# EAGLE design Singularitron Breathalyzer Module (EAGLE 7.3.0)
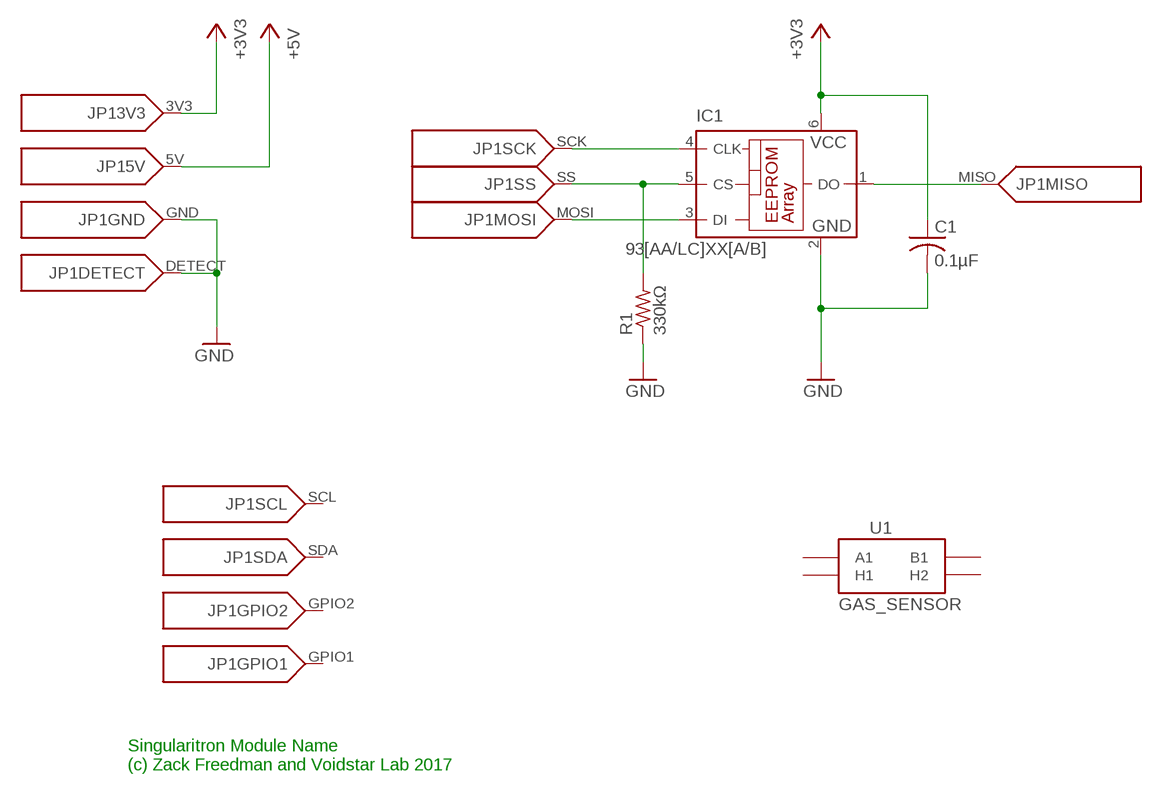
[diagram p0: schematic, sheet 1]

## Parts
C1  0.1µF  C-USC0603  [C0603]
IC1  93[AA/LC]XX[A/B]  93AA76A  [SOT23-6]
JP1  SINGULARITRON_CART_BASE  [SINGULARITRON_CART_BASE]
R1  330kΩ  R-US_R0603  [R0603]
U1  GAS_SENSOR  [MQ-3]

## Nets
+3V3: C1.1 IC1.6(VCC) JP1.3V3
+5V: JP1.5V
GND: C1.2 IC1.2(GND) JP1.DETECT JP1.GND R1.1
N$1: IC1.5(CS) JP1.SS R1.2
N$5: IC1.4(CLK) JP1.SCK
N$6: IC1.3(DI) JP1.MOSI
N$7: IC1.1(DO) JP1.MISO
Unconnected: JP1.GPIO1 JP1.GPIO2 JP1.SCL JP1.SDA U1.A1 U1.B1 U1.HA(H1) U1.HB(H2)

## Notes on the sheet
- Singularitron Module Name
  (c) Zack Freedman and Voidstar Lab 2017

## Library data of the parts
C1 = rcl:C-US: CAPACITOR, American symbol
IC1 = microchip:93*76?: 8K Microwire Compatible Serial EEPROM Source: http://ww1.microchip.com/downloads/en/DeviceDoc/21796H.pdf; MPN: 93AA76AT-I/OT; OC_FARNELL: 1331443; OC_NEWARK: 35M2481
JP1 = Voidstar-Exotic:SINGULARITRON_CART_BASE
R1 = rcl:R-US_: RESISTOR, American symbol
U1 = SparkFun-Sensors:GAS_SENSOR: MQ-3 alcohol gas sensor . FP not tested. SEN-08880.

## Board
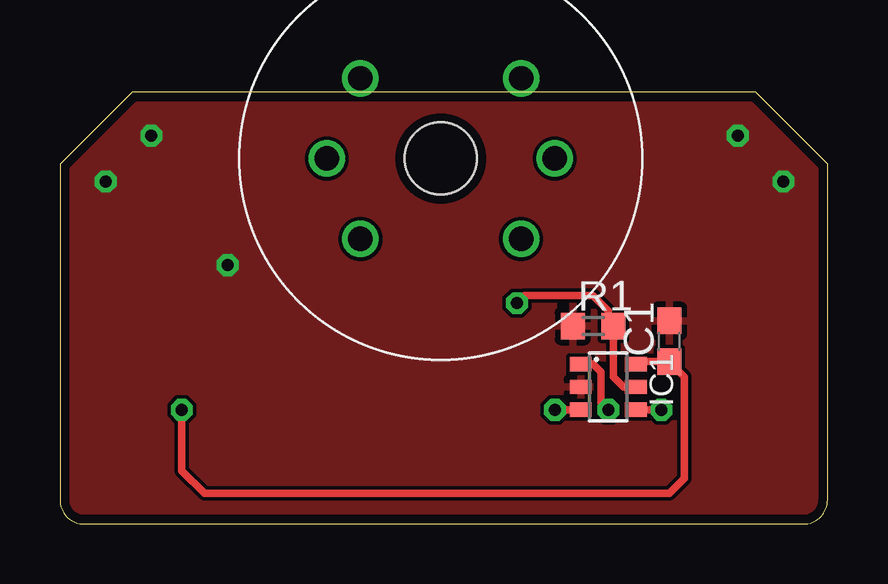
[diagram p1: board, top side]
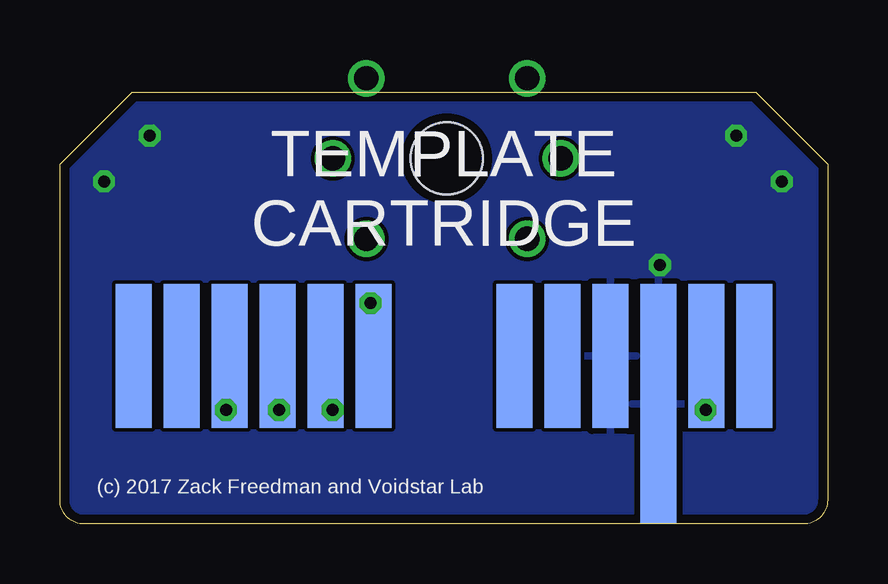
[diagram p2: board, bottom side, seen from below]

Size 32 x 18 mm. Coordinates in mm from the lower left corner, seen from the top.
Outline: 29,18 3,18 0,15 0,1 arc90 1,0 31,0 arc90 32,1 32,15 29,18
Copper layers (1*2*15*16): Top 0.035559375mm / dielectric 1.501140625mm / Route2 0.035559375mm / dielectric 0.149859375mm / Route15 0.035559375mm / dielectric 0.200659375mm / Bottom 0.035559375mm
Design rules "dl-Singularitron 1B": minimum track width 7mil, minimum drill 15mil, track to track 6mil, track to pad 6mil, pad to pad 6mil, via to via 6mil, smd to smd 6mil, copper to edge 15mil, drill to drill 8mil, minimum pad ring 4mil, minimum via ring 8mil, stop-mask expansion 2mil, vias tented up to drill 24mil, thermal gap 10mil

### Footprints (pad centres in the part's own frame; a part is rotated, then mirrored left to right if it is on the bottom)
C0603 = smd 1.1 x 1: 1 -0.85,0; 2 0.85,0
SOT23-6 = smd 0.6 x 0.9: 1 -0.95,-1.15; 2 0,-1.15; 3 0.95,-1.15; 4 0.95,1.15; 5 0,1.15; 6 -0.95,1.15
SINGULARITRON_CART_BASE = smd 1.5 x 6 bottom: 3V3 5.062,7; 5V 3.062,7; DETECT 9.062,7; GPIO1 11.062,7; GPIO2 13.062,7; MISO 22.938,7; MOSI 20.938,7; SCK 24.938,7; SCL 28.938,7; SDA 26.938,7; SS 18.938,7 | smd 1.5 x 10 bottom: GND 7.062,5
R0603 = smd 1 x 1.1: 1 -0.85,0; 2 0.85,0
MQ-3 = drill 1.016: A1 -3.35,3.35; A2 -3.35,-3.35; B1 3.35,3.35; B2 3.35,-3.35; HA -4.75,0; HB 4.75,0 | hole 3: 0,0

### Placement (x,y rotation side)
C1  25.4,7.62 90 top
IC1  22.86,5.71 270 top
JP1  0,0 0 top
R1  22.23,8.26 0 top
U1  15.88,15.24 0 top

### Tracks (layer width: path | path; a pad name or v marks a point on that pad's centre or on a via)
+3V3  (via drill 0.5)
  Top 0.305: IC1.6 24.11,6.77 C1.1 26.04,6.13 26.04,1.91 25.4,1.27 6.03,1.27 5.08,2.22 v5.08,4.76
  Bottom 0.305: JP1.3V3 5.08,6.98 v5.08,4.76
GND  (via drill 0.5)
  other vias: 6.99,10.79 3.81,16.19 28.26,16.19 30.16,14.29 1.91,14.29 16.19,16.19
  pour Top: 0,0 0,19.05 33.02,19.05 33.02,0
  pour Bottom: 0,0 0,19.05 33.02,19.05 33.02,0
N$1  (via drill 0.5)
  Top 0.305: v19.05,9.21 19.37,9.53 22.23,9.53 22.86,8.89 22.86,8.47 R1.2 23.07,6.13 23.5,5.71 IC1.5
  Bottom 0.305: JP1.SS 18.94,9.1 v19.05,9.21
N$5  (via drill 0.5)
  Top 0.305: IC1.4 v25.08,4.76
  Bottom 0.305: JP1.SCK 24.94,4.91 v25.08,4.76
N$6  (via drill 0.5)
  Top 0.305: IC1.3 v20.64,4.76
  Bottom 0.305: JP1.MOSI 20.94,5.06 v20.64,4.76
N$7  (via drill 0.5)
  Top 0.305: IC1.1 22.23,6.67 22.54,6.35 22.54,5.08 v22.86,4.76
  Bottom 0.305: JP1.MISO 22.86,6.92 v22.86,4.76

### Text on the board
bPlace: TEMPLATE / CARTRIDGE | (c) 2017 Zack Freedman and Voidstar Lab